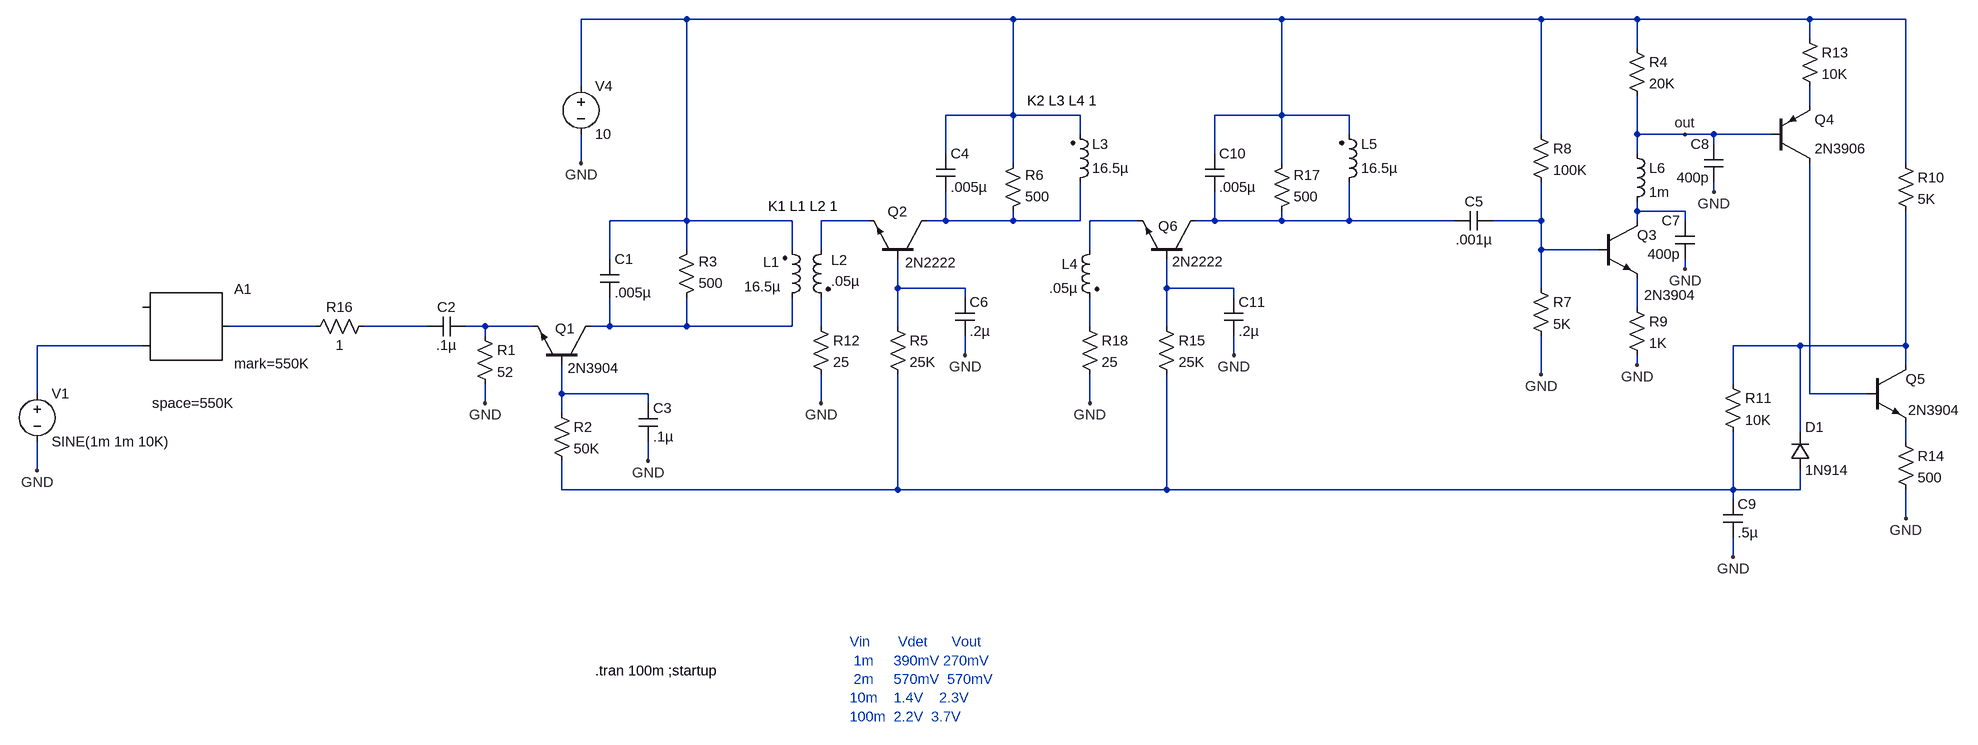
[diagram p0: schematic IF.asc]
IF.asc, the LTspice schematic file:
Version 4
SHEET 1 4068 2144
WIRE 1776 1312 1808 1312
WIRE 2112 1312 2112 1264
WIRE 1808 1312 1808 1264
WIRE 1808 1312 1936 1312
WIRE 1808 1136 1936 1136
WIRE 2112 1184 2112 1136
WIRE 1808 1200 1808 1136
WIRE 1680 1312 1600 1312
WIRE 1600 1312 1600 1328
WIRE 1600 1408 1600 1440
WIRE 1600 1312 1568 1312
WIRE 1504 1312 1296 1312
WIRE 752 1344 752 1424
WIRE 752 1504 752 1552
WIRE 1728 1376 1728 1424
WIRE 1728 1536 1728 1584
WIRE 1728 1424 1728 1456
WIRE 1728 1424 1872 1424
WIRE 1872 1424 1872 1440
WIRE 1872 1504 1872 1536
WIRE 1936 1136 1936 800
WIRE 1936 1136 2112 1136
WIRE 1936 1136 1936 1184
WIRE 1936 1264 1936 1312
WIRE 1936 1312 2112 1312
WIRE 2336 1136 2368 1136
WIRE 2592 1136 2592 1072
WIRE 2368 1136 2368 1088
WIRE 2368 1136 2480 1136
WIRE 2368 960 2480 960
WIRE 2592 992 2592 960
WIRE 2368 1024 2368 960
WIRE 2240 1136 2160 1136
WIRE 2288 1200 2288 1248
WIRE 2288 1248 2288 1312
WIRE 2288 1248 2400 1248
WIRE 2400 1248 2400 1264
WIRE 2400 1328 2400 1360
WIRE 2480 960 2592 960
WIRE 2480 960 2480 1040
WIRE 2480 1120 2480 1136
WIRE 2480 1136 2592 1136
WIRE 2160 1136 2160 1184
WIRE 2160 1264 2160 1312
WIRE 3520 1136 3520 1120
WIRE 3520 1024 3520 992
WIRE 1760 1040 1760 992
WIRE 1760 912 1760 800
WIRE 1760 800 1936 800
WIRE 3520 1376 3520 1360
WIRE 3520 848 3520 800
WIRE 3360 1328 3360 1392
WIRE 3360 1136 3280 1136
WIRE 3520 992 3600 992
WIRE 3520 992 3520 928
WIRE 3600 1216 3600 1200
WIRE 3520 1120 3520 1104
WIRE 3360 1136 3360 1072
WIRE 3520 1280 3520 1232
WIRE 3360 992 3360 800
WIRE 3360 1184 3360 1136
WIRE 3456 1184 3360 1184
WIRE 3360 1184 3360 1248
WIRE 1936 800 2480 800
WIRE 2480 800 2928 800
WIRE 3360 800 3520 800
WIRE 3600 1136 3600 1120
WIRE 3600 1120 3520 1120
WIRE 3680 1584 3680 1600
WIRE 3680 1664 3680 1696
WIRE 928 1344 752 1344
WIRE 2288 1392 2288 1584
WIRE 2288 1584 1728 1584
WIRE 3216 1136 3040 1136
WIRE 3808 944 3808 912
WIRE 3808 800 3520 800
WIRE 3808 1040 3808 1424
WIRE 3808 1424 3904 1424
WIRE 3968 1472 3968 1504
WIRE 3680 1584 3680 1488
WIRE 3968 1344 3968 1376
WIRE 3808 800 3968 800
WIRE 3968 800 3968 1040
WIRE 3968 1120 3968 1344
WIRE 3680 1408 3680 1344
WIRE 3808 832 3808 800
WIRE 3968 1584 3968 1632
WIRE 3600 992 3648 992
WIRE 3648 1088 3648 1072
WIRE 3648 1008 3648 992
WIRE 3648 992 3744 992
WIRE 2160 1392 2160 1440
WIRE 3680 1344 3792 1344
WIRE 3792 1344 3792 1488
WIRE 3792 1552 3792 1584
WIRE 3792 1584 3680 1584
WIRE 2480 960 2480 800
WIRE 3792 1344 3968 1344
WIRE 3680 1584 2736 1584
WIRE 1216 1312 1072 1312
WIRE 3040 1136 3040 1072
WIRE 2816 1136 2816 1088
WIRE 2816 960 2928 960
WIRE 3040 992 3040 960
WIRE 2816 1024 2816 960
WIRE 2736 1200 2736 1248
WIRE 2736 1248 2736 1312
WIRE 2736 1248 2848 1248
WIRE 2848 1248 2848 1264
WIRE 2848 1328 2848 1360
WIRE 2928 960 3040 960
WIRE 2928 960 2928 1040
WIRE 2928 1120 2928 1136
WIRE 2608 1136 2608 1184
WIRE 2608 1264 2608 1312
WIRE 2736 1392 2736 1584
WIRE 2608 1392 2608 1440
WIRE 2928 960 2928 800
WIRE 2688 1136 2608 1136
WIRE 2928 800 3360 800
WIRE 2816 1136 2784 1136
WIRE 3040 1136 2928 1136
WIRE 2736 1584 2288 1584
WIRE 2928 1136 2816 1136
FLAG 1600 1440 GND
FLAG 752 1552 GND
FLAG 1872 1536 GND
FLAG 2400 1360 GND
FLAG 2160 1440 GND
FLAG 3520 1376 GND
FLAG 1760 1040 GND
FLAG 3360 1392 GND
FLAG 3600 1216 GND
FLAG 3680 1696 GND
FLAG 3968 1632 GND
FLAG 3600 992 out
FLAG 3648 1088 GND
FLAG 2848 1360 GND
FLAG 2608 1440 GND
SYMBOL npn 1776 1376 M270
WINDOW 0 60 59 VLeft 0
WINDOW 3 -6 38 VLeft 0
SYMATTR InstName Q1
SYMATTR Value 2N3904
SYMBOL ind2 2096 1280 M180
WINDOW 0 -5 75 Right 0
WINDOW 3 -3 34 Right 0
SYMATTR InstName L1
SYMATTR Value 16.5µ
SYMBOL cap 1792 1264 M180
WINDOW 0 24 64 Left 0
WINDOW 3 24 8 Left 0
SYMATTR InstName C1
SYMATTR Value .005µ
SYMBOL res 1584 1312 R0
SYMATTR InstName R1
SYMATTR Value 52
SYMBOL cap 1568 1296 R90
WINDOW 0 0 32 VBottom 0
WINDOW 3 32 32 VTop 0
SYMATTR InstName C2
SYMATTR Value .1µ
SYMBOL voltage 752 1408 R0
SYMATTR InstName V1
SYMATTR Value SINE(1m 1m 10K)
SYMBOL res 1712 1440 R0
SYMATTR InstName R2
SYMATTR Value 50K
SYMBOL cap 1856 1440 R0
SYMATTR InstName C3
SYMATTR Value .1µ
SYMBOL res 1920 1280 M180
WINDOW 0 36 76 Left 0
WINDOW 3 36 40 Left 0
SYMATTR InstName R3
SYMATTR Value 500
SYMBOL npn 2336 1200 M270
WINDOW 0 79 65 VLeft 0
WINDOW 3 -6 36 VLeft 0
SYMATTR InstName Q2
SYMATTR Value 2N2222
SYMBOL ind2 2576 1088 M180
WINDOW 0 36 80 Left 0
WINDOW 3 36 40 Left 0
SYMATTR InstName L3
SYMATTR Value 16.5µ
SYMBOL cap 2352 1088 M180
WINDOW 0 24 64 Left 0
WINDOW 3 24 8 Left 0
SYMATTR InstName C4
SYMATTR Value .005µ
SYMBOL res 2272 1296 R0
SYMATTR InstName R5
SYMATTR Value 25K
SYMBOL cap 2384 1264 R0
SYMATTR InstName C6
SYMATTR Value .2µ
SYMBOL res 2464 1136 M180
WINDOW 0 36 76 Left 0
WINDOW 3 36 40 Left 0
SYMATTR InstName R6
SYMATTR Value 500
SYMBOL ind2 2176 1168 M0
WINDOW 0 -1 34 Right 0
WINDOW 3 -1 69 Right 0
SYMATTR InstName L2
SYMATTR Value .05µ
SYMBOL ind 3504 1008 R0
SYMATTR InstName L6
SYMATTR Value 1m
SYMBOL voltage 1760 896 R0
SYMATTR InstName V4
SYMATTR Value 10
SYMBOL res 3504 832 R0
SYMATTR InstName R4
SYMATTR Value 20K
SYMBOL res 3344 1232 R0
SYMATTR InstName R7
SYMATTR Value 5K
SYMBOL cap 3280 1120 R90
WINDOW 0 0 32 VBottom 0
WINDOW 3 32 32 VTop 0
SYMATTR InstName C5
SYMATTR Value .001µ
SYMBOL cap 3616 1200 R180
WINDOW 0 24 64 Left 0
WINDOW 3 24 8 Left 0
SYMATTR InstName C7
SYMATTR Value 400p
SYMBOL npn 3456 1136 R0
WINDOW 0 64 24 Left 0
WINDOW 3 76 124 Left 0
SYMATTR InstName Q3
SYMATTR Value 2N3904
SYMBOL res 3344 976 R0
SYMATTR InstName R8
SYMATTR Value 100K
SYMBOL res 3504 1264 R0
SYMATTR InstName R9
SYMATTR Value 1K
SYMBOL res 3952 1024 R0
SYMATTR InstName R10
SYMATTR Value 5K
SYMBOL cap 3664 1600 R0
SYMATTR InstName C9
SYMATTR Value .5µ
SYMBOL SpecialFunctions\modulate 928 1280 R0
WINDOW 123 16 160 Left 0
SYMATTR InstName A1
SYMATTR Value mark=550K
SYMATTR Value2 space=550K
SYMBOL pnp 3744 1040 M180
WINDOW 0 72 72 Left 0
WINDOW 3 72 24 Left 0
SYMATTR InstName Q4
SYMATTR Value 2N3906
SYMBOL npn 3904 1376 R0
WINDOW 0 64 24 Left 0
WINDOW 3 68 76 Left 0
SYMATTR InstName Q5
SYMATTR Value 2N3904
SYMBOL res 3664 1392 R0
SYMATTR InstName R11
SYMATTR Value 10K
SYMBOL res 3792 816 R0
SYMATTR InstName R13
SYMATTR Value 10K
SYMBOL res 3952 1488 R0
SYMATTR InstName R14
SYMATTR Value 500
SYMBOL cap 3664 1072 R180
WINDOW 0 24 64 Left 0
WINDOW 3 24 8 Left 0
SYMATTR InstName C8
SYMATTR Value 400p
SYMBOL res 2144 1296 R0
SYMATTR InstName R12
SYMATTR Value 25
SYMBOL diode 3776 1552 M180
WINDOW 0 24 72 Left 0
WINDOW 3 24 0 Left 0
SYMATTR InstName D1
SYMATTR Value 1N914
SYMBOL res 1312 1296 R90
WINDOW 0 0 56 VBottom 0
WINDOW 3 32 56 VTop 0
SYMATTR InstName R16
SYMATTR Value 1
SYMBOL npn 2784 1200 M270
WINDOW 0 55 62 VLeft 0
WINDOW 3 -4 39 VLeft 0
SYMATTR InstName Q6
SYMATTR Value 2N2222
SYMBOL ind2 3024 1088 M180
WINDOW 0 36 80 Left 0
WINDOW 3 36 40 Left 0
SYMATTR InstName L5
SYMATTR Value 16.5µ
SYMBOL cap 2800 1088 M180
WINDOW 0 24 64 Left 0
WINDOW 3 24 8 Left 0
SYMATTR InstName C10
SYMATTR Value .005µ
SYMBOL res 2720 1296 R0
SYMATTR InstName R15
SYMATTR Value 25K
SYMBOL cap 2832 1264 R0
SYMATTR InstName C11
SYMATTR Value .2µ
SYMBOL res 2912 1136 M180
WINDOW 0 36 76 Left 0
WINDOW 3 36 40 Left 0
SYMATTR InstName R17
SYMATTR Value 500
SYMBOL ind2 2624 1168 M0
SYMATTR InstName L4
SYMATTR Value .05µ
SYMBOL res 2592 1296 R0
SYMATTR InstName R18
SYMATTR Value 25
text 1784 2064 Left 0 !.tran 100m ;startup
text 2072 1112 Left 0 !K1 L1 L2 1
text 2208 2016 Left 0 ;Vin       Vdet      Vout\n 1m     390mV 270mV\n 2m     570mV  570mV\n10m    1.4V    2.3V\n100m  2.2V  3.7V
text 2504 936 Left 0 !K2 L3 L4 1

The netlist it stands for:
* IF.asc
Q1 N001 N006 N003 0 2N3904
L1 N001 N002 16.5µ
C1 N001 N002 .005µ
R1 N003 GND 52
C2 N003 N004 .1µ
V1 N005 GND SINE(1m 1m 10K)
R2 N006 N007 50K
C3 N006 GND .1µ
R3 N001 N002 500
Q2 N008 N010 N009 0 2N2222
L3 N008 N002 16.5µ
C4 N008 N002 .005µ
R5 N010 N007 25K
C6 N010 GND .2µ
R6 N008 N002 500
L2 N009 N011 .05µ
L6 out N012 1m
V4 N002 GND 10
R4 N002 out 20K
R7 N013 GND 5K
C5 N013 N015 .001µ
C7 GND N012 400p
Q3 N012 N013 N014 0 2N3904
R8 N002 N013 100K
R9 N014 GND 1K
R10 N002 N019 5K
C9 N007 GND .5µ
A1 0 N005 0 0 0 0 N020 0 MODULATOR mark=550K space=550K
Q4 N017 out N016 0 2N3906
Q5 N019 N017 N018 0 2N3904
R11 N019 N007 10K
R13 N002 N016 10K
R14 N018 GND 500
C8 GND out 400p
R12 N011 GND 25
D1 N007 N019 1N914
R16 N004 N020 1
Q6 N015 N021 N022 0 2N2222
L5 N015 N002 16.5µ
C10 N015 N002 .005µ
R15 N021 N007 25K
C11 N021 GND .2µ
R17 N015 N002 500
L4 N022 N023 .05µ
R18 N023 GND 25
.model D D
.lib standard.dio
.model NPN NPN
.model PNP PNP
.lib standard.bjt
.tran 100m ;startup
K1 L1 L2 1
* Vin       Vdet      Vout
*  1m     390mV 270mV
*  2m     570mV  570mV
* 10m    1.4V    2.3V
* 100m  2.2V  3.7V
K2 L3 L4 1
.backanno
.end